# EAGLE design esp32_feather (EAGLE 7.7.0)

## Sheet 1 of 3
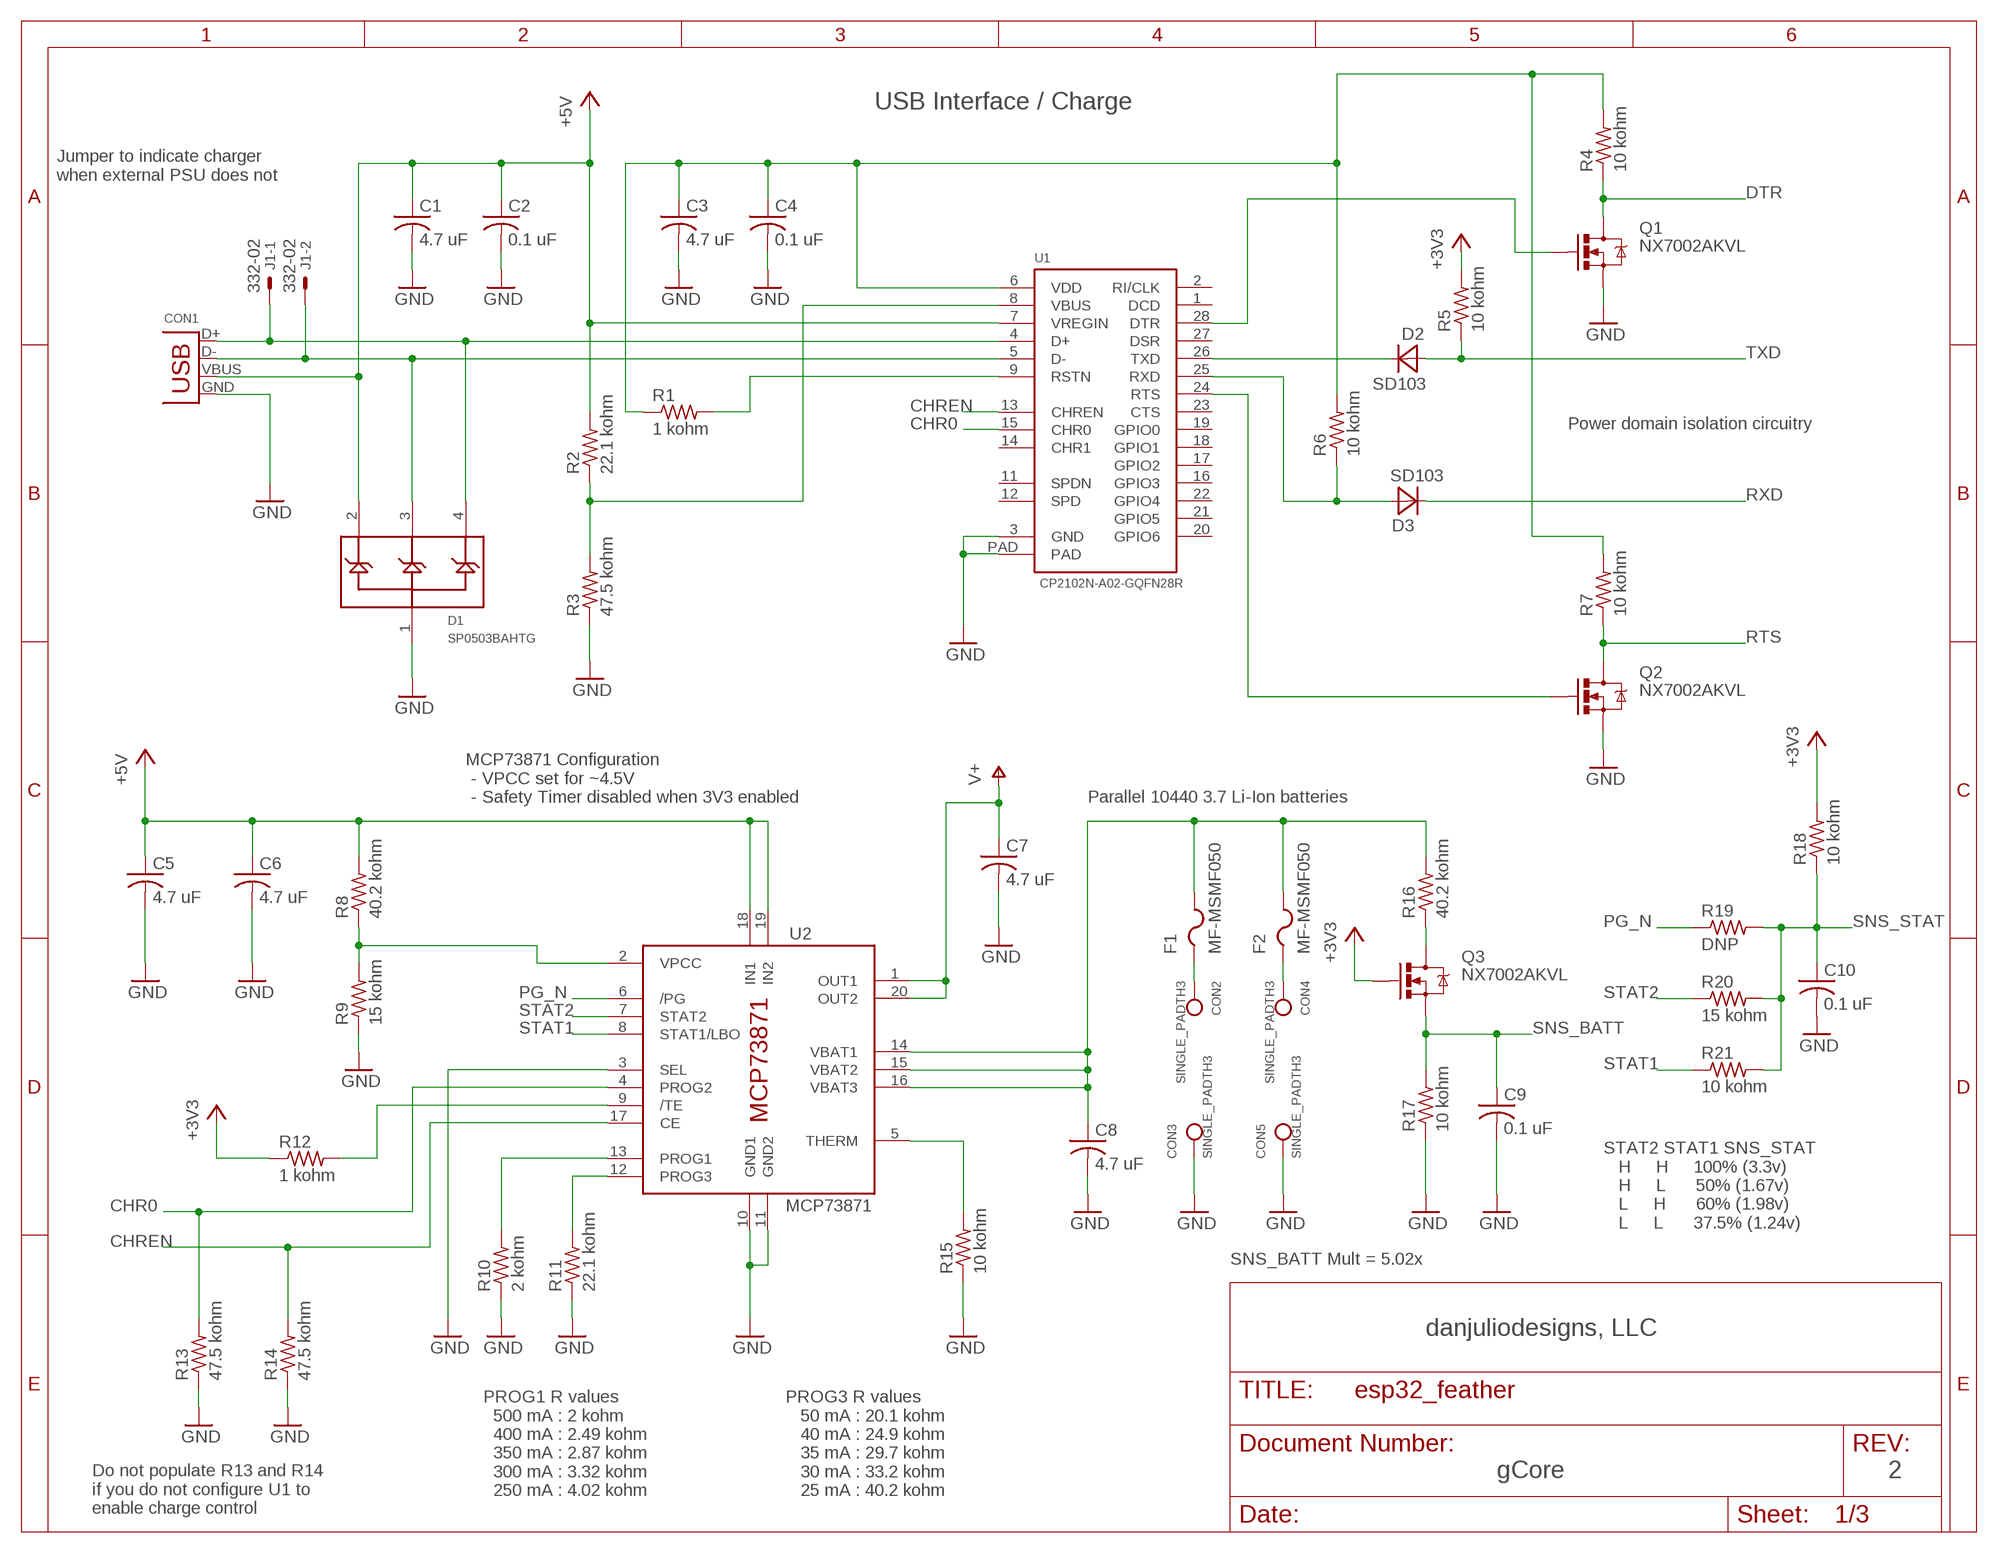
[diagram p0: schematic, sheet 1]

### Parts
C1  4.7 uF  C-USSMT0603  [C0603]
C2  0.1 uF  C-USSMT0603  [C0603]
C3  4.7 uF  C-USSMT0603  [C0603]
C4  0.1 uF  C-USSMT0603  [C0603]
C5  4.7 uF  C-USSMT0603  [C0603]
C6  4.7 uF  C-USSMT0603  [C0603]
C7  4.7 uF  C-USSMT0603  [C0603]
C8  4.7 uF  C-USSMT0603  [C0603]
C9  0.1 uF  C-USSMT0603  [C0603]
C10  0.1 uF  C-USSMT0603  [C0603]
CON1  USBMICROB  [USB_MICROB_SMT]
CON2  SINGLE_PADTH3  [SINGLE_PAD_POWER]
CON3  SINGLE_PADTH3  [SINGLE_PAD_POWER]
CON4  SINGLE_PADTH3  [SINGLE_PAD_POWER]
CON5  SINGLE_PADTH3  [SINGLE_PAD_POWER]
D1  SP0503BAHTG  [SOT143]
D2  SD103  DIODESMT_SOD123  [SOD123]
D3  SD103  DIODESMT_SOD123  [SOD123]
F1  MF-MSMF050  PTCFUSE-1812  [1812]
F2  MF-MSMF050  PTCFUSE-1812  [1812]
J1  332-02  [332-02]
Q1  NX7002AKVL  MOSFET-NCHANNELSOT23  [SOT23-3]
Q2  NX7002AKVL  MOSFET-NCHANNELSOT23  [SOT23-3]
Q3  NX7002AKVL  MOSFET-NCHANNELSOT23  [SOT23-3]
R1  1 kohm  R-USSMT0603  [R0603]
R2  22.1 kohm  R-USSMT0603  [R0603]
R3  47.5 kohm  R-USSMT0603  [R0603]
R4  10 kohm  R-USSMT0603  [R0603]
R5  10 kohm  R-USSMT0603  [R0603]
R6  10 kohm  R-USSMT0603  [R0603]
R7  10 kohm  R-USSMT0603  [R0603]
R8  40.2 kohm  R-USSMT0603  [R0603]
R9  15 kohm  R-USSMT0603  [R0603]
R10  2 kohm  R-USSMT0603  [R0603]
R11  22.1 kohm  R-USSMT0603  [R0603]
R12  1 kohm  R-USSMT0603  [R0603]
R13  47.5 kohm  R-USSMT0603  [R0603]
R14  47.5 kohm  R-USSMT0603  [R0603]
R15  10 kohm  R-USSMT0603  [R0603]
R16  40.2 kohm  R-USSMT0603  [R0603]
R17  10 kohm  R-USSMT0603  [R0603]
R18  10 kohm  R-USSMT0603  [R0603]
R19  DNP  R-USSMT0603  [R0603]
R20  15 kohm  R-USSMT0603  [R0603]
R21  10 kohm  R-USSMT0603  [R0603]
U1  CP2102N-A02-GQFN28R  CP2102N_QFN28  [QFN28]
U2  MCP73871  [QFN20]

### Nets
+3V3: Q3.1(G) R5.2 R12.1 R18.2 ; also sheet 2,3
+5V: C1.1 C2.1 C5.1 C6.1 CON1.VBUS D1.2(C1) R2.2 R8.2 U1.7(VREGIN) U2.18(IN1) U2.19(IN2) ; also sheet 3
CHR0: R13.2 U1.15(CHR0) U2.4(PROG2)
CHREN: R14.2 U1.13(CHREN) U2.17(CE)
DTR: Q1.3(D) R4.1 ; also sheet 2
GND: C1.2 C2.2 C3.2 C4.2 C5.2 C6.2 C7.2 C8.2 C9.2 C10.2 CON1.GND CON3.P$1 CON5.P$1 D1.1(GND) Q1.2(S) Q2.2(S) R3.1 R9.1 R10.1 R11.1 R13.1 R14.1 R15.1 R17.1 U1.3(GND) U1.PAD U2.3(SEL) U2.10(GND1) U2.11(GND2) ; also sheet 2,3
N$1: CON1.D+ D1.4(C3) J1.1 U1.4(D+)
N$2: CON1.D- D1.3(C2) J1.2 U1.5(D-)
N$3: R15.2 U2.5(THERM)
N$4: C8.1 F1.2 F2.2 R16.2 U2.14(VBAT1) U2.15(VBAT2) U2.16(VBAT3)
N$5: R1.2 U1.9(RSTN)
N$6: Q1.1(G) U1.28(DTR)
N$7: R8.1 R9.2 U2.2(VPCC)
N$8: R2.1 R3.2 U1.8(VBUS)
N$9: D2.C U1.26(TXD)
N$10: D3.A R6.1 U1.25(RXD)
N$11: Q2.1(G) U1.24(RTS)
N$12: R10.2 U2.13(PROG1)
N$13: R11.2 U2.12(PROG3)
N$14: CON2.P$1 F1.1
N$15: CON4.P$1 F2.1
N$16: R12.2 U2.9(/TE)
N$18: Q3.3(D) R16.1
PG_N: R19.1 U2.6(/PG)
RTS: Q2.3(D) R7.1 ; also sheet 2
RXD: D3.C ; also sheet 2
SNS_BATT: C9.1 Q3.2(S) R17.2 ; also sheet 2
SNS_STAT: C10.1 R18.1 R19.2 R20.2 R21.2 ; also sheet 2
STAT1: R21.1 U2.8(STAT1/LBO)
STAT2: R20.1 U2.7(STAT2)
TXD: D2.A R5.1 ; also sheet 2
V+: C7.1 U2.1(OUT1) U2.20(OUT2) ; also sheet 2,3
VDD: C3.1 C4.1 R1.1 R4.2 R6.2 R7.2 U1.6(VDD)
Unconnected: U1.1(DCD) U1.2(RI/CLK) U1.11(SPDN) U1.12(SPD) U1.14(CHR1) U1.16(GPIO3) U1.17(GPIO2) U1.18(GPIO1) U1.19(GPIO0) U1.20(GPIO6) U1.21(GPIO5) U1.22(GPIO4) U1.23(CTS) U1.27(DSR)

### Notes on the sheet
- USB Interface / Charge
- Jumper to indicate charger
  when external PSU does not
- Power domain isolation circuitry
- MCP73871 Configuration
   - VPCC set for ~4.5V
   - Safety Timer disabled when 3V3 enabled
- Parallel 10440 3.7 Li-Ion batteries
- STAT2 STAT1 SNS_STAT
     H     H     100% (3.3v)
     H     L      50% (1.67v)
     L     H      60% (1.98v)
     L     L      37.5% (1.24v)
- SNS_BATT Mult = 5.02x
- danjuliodesigns, LLC
- gCore | 2
- PROG1 R values
    500 mA : 2 kohm
    400 mA : 2.49 kohm
    350 mA : 2.87 kohm
    300 mA : 3.32 kohm
    250 mA : 4.02 kohm
- PROG3 R values
     50 mA : 20.1 kohm
     40 mA : 24.9 kohm
     35 mA : 29.7 kohm
     30 mA : 33.2 kohm
     25 mA : 40.2 kohm
- Do not populate R13 and R14
  if you do not configure U1 to
  enable charge control

## Sheet 2 of 3
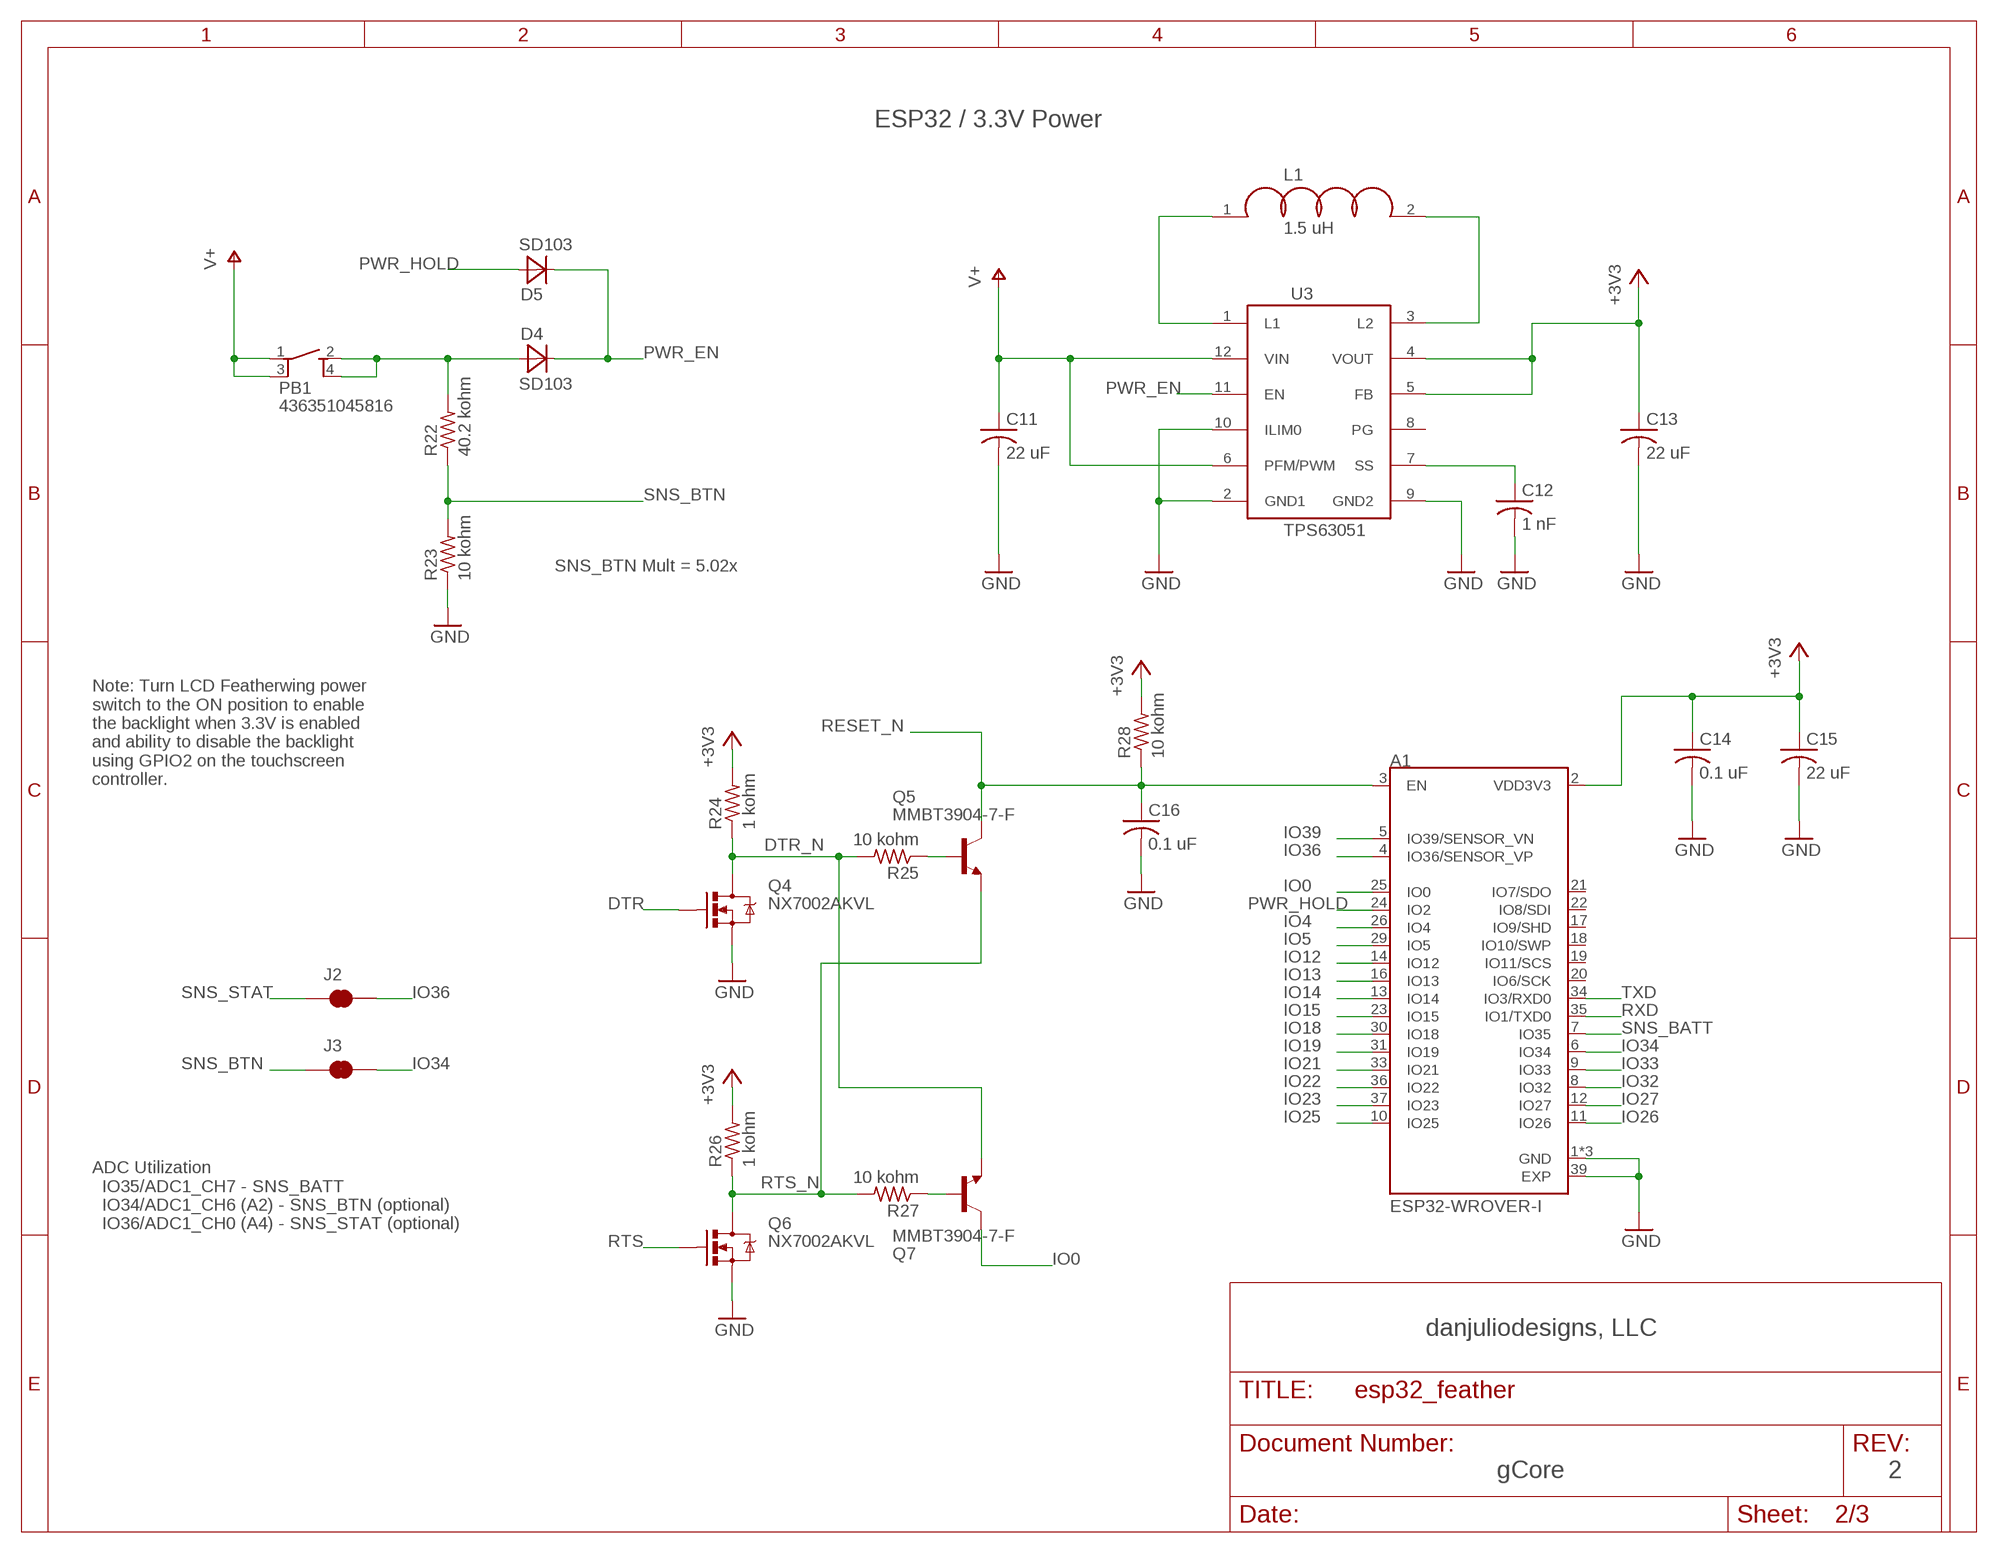
[diagram p1: schematic, sheet 2]

### Parts
A1  ESP32-WROVER-I  [XCVR_ESP32-WROVER-I]
C11  22 uF  C-USSMT0603  [C0603]
C12  1 nF  C-USSMT0603  [C0603]
C13  22 uF  C-USSMT0603  [C0603]
C14  0.1 uF  C-USSMT0603  [C0603]
C15  22 uF  C-USSMT0603  [C0603]
C16  0.1 uF  C-USSMT0603  [C0603]
D4  SD103  DIODESMT_SOD123  [SOD123]
D5  SD103  DIODESMT_SOD123  [SOD123]
J2  SJ_WIRED  [SJ_2B_ADA]
J3  SJ_WIRED  [SJ_2B_ADA]
L1  1.5 uH  INDUCTORSMT1008  [L1008]
PB1  436351045816  PB_TACT_4WS  [WURTH_WS_TASU_TACT]
Q4  NX7002AKVL  MOSFET-NCHANNELSOT23  [SOT23-3]
Q5  MMBT3904-7-F  BC808-NPN-SOT23-BEC  [SOT23-BEC]
Q6  NX7002AKVL  MOSFET-NCHANNELSOT23  [SOT23-3]
Q7  MMBT3904-7-F  BC808-NPN-SOT23-BEC  [SOT23-BEC]
R22  40.2 kohm  R-USSMT0603  [R0603]
R23  10 kohm  R-USSMT0603  [R0603]
R24  1 kohm  R-USSMT0603  [R0603]
R25  10 kohm  R-USSMT0603  [R0603]
R26  1 kohm  R-USSMT0603  [R0603]
R27  10 kohm  R-USSMT0603  [R0603]
R28  10 kohm  R-USSMT0603  [R0603]
U3  TPS63051  TPS63051_QFN  [HOTROD_QFN12]

### Nets
+3V3: A1.2(VDD3V3) C13.1 C14.1 C15.1 R24.2 R26.2 R28.2 U3.4(VOUT) U3.5(FB) ; also sheet 1,3
DTR: Q4.1(G) ; also sheet 1
DTR_N: Q4.3(D) Q7.E R24.1 R25.2
GND: A1.1(GND) A1.15(GND) A1.38(GND) A1.39(EXP) C11.2 C12.2 C13.2 C14.2 C15.2 C16.2 Q4.2(S) Q6.2(S) R23.1 U3.2(GND1) U3.9(GND2) U3.10(ILIM0) ; also sheet 1,3
IO0: A1.25(IO0) Q7.C
IO4: A1.26(IO4) ; also sheet 3
IO5: A1.29(IO5) ; also sheet 3
IO12: A1.14(IO12) ; also sheet 3
IO13: A1.16(IO13) ; also sheet 3
IO14: A1.13(IO14) ; also sheet 3
IO15: A1.23(IO15) ; also sheet 3
IO18: A1.30(IO18) ; also sheet 3
IO19: A1.31(IO19) ; also sheet 3
IO21: A1.33(IO21) ; also sheet 3
IO22: A1.36(IO22) ; also sheet 3
IO23: A1.37(IO23) ; also sheet 3
IO25: A1.10(IO25) ; also sheet 3
IO26: A1.11(IO26) ; also sheet 3
IO27: A1.12(IO27) ; also sheet 3
IO32: A1.8(IO32) ; also sheet 3
IO33: A1.9(IO33) ; also sheet 3
IO34: A1.6(IO34) J3.2 ; also sheet 3
IO36: A1.4(IO36/SENSOR_VP) J2.2 ; also sheet 3
IO39: A1.5(IO39/SENSOR_VN) ; also sheet 3
N$17: L1.1 U3.1(L1)
N$19: L1.2 U3.3(L2)
N$20: C12.1 U3.7(SS)
N$21: D4.A PB1.2 PB1.4 R22.2
N$26: Q5.B R25.1
N$27: Q7.B R27.1
PWR_EN: D4.C D5.C U3.11(EN)
PWR_HOLD: A1.24(IO2) D5.A
RESET_N: A1.3(EN) C16.1 Q5.C R28.1 ; also sheet 3
RTS: Q6.1(G) ; also sheet 1
RTS_N: Q5.E Q6.3(D) R26.1 R27.2
RXD: A1.35(IO1/TXD0) ; also sheet 1
SNS_BATT: A1.7(IO35) ; also sheet 1
SNS_BTN: J3.1 R22.1 R23.2
SNS_STAT: J2.1 ; also sheet 1
TXD: A1.34(IO3/RXD0) ; also sheet 1
V+: C11.1 PB1.1 PB1.3 U3.6(PFM/PWM) U3.12(VIN) ; also sheet 1,3
Unconnected: A1.17(IO9/SHD) A1.18(IO10/SWP) A1.19(IO11/SCS) A1.20(IO6/SCK) A1.21(IO7/SDO) A1.22(IO8/SDI) U3.8(PG)

### Notes on the sheet
- ESP32 / 3.3V Power
- SNS_BTN Mult = 5.02x
- Note: Turn LCD Featherwing power
  switch to the ON position to enable
  the backlight when 3.3V is enabled
  and ability to disable the backlight
  using GPIO2 on the touchscreen
  controller.
- ADC Utilization
    IO35/ADC1_CH7 - SNS_BATT
    IO34/ADC1_CH6 (A2) - SNS_BTN (optional)
    IO36/ADC1_CH0 (A4) - SNS_STAT (optional)
- danjuliodesigns, LLC
- gCore | 2

## Sheet 3 of 3
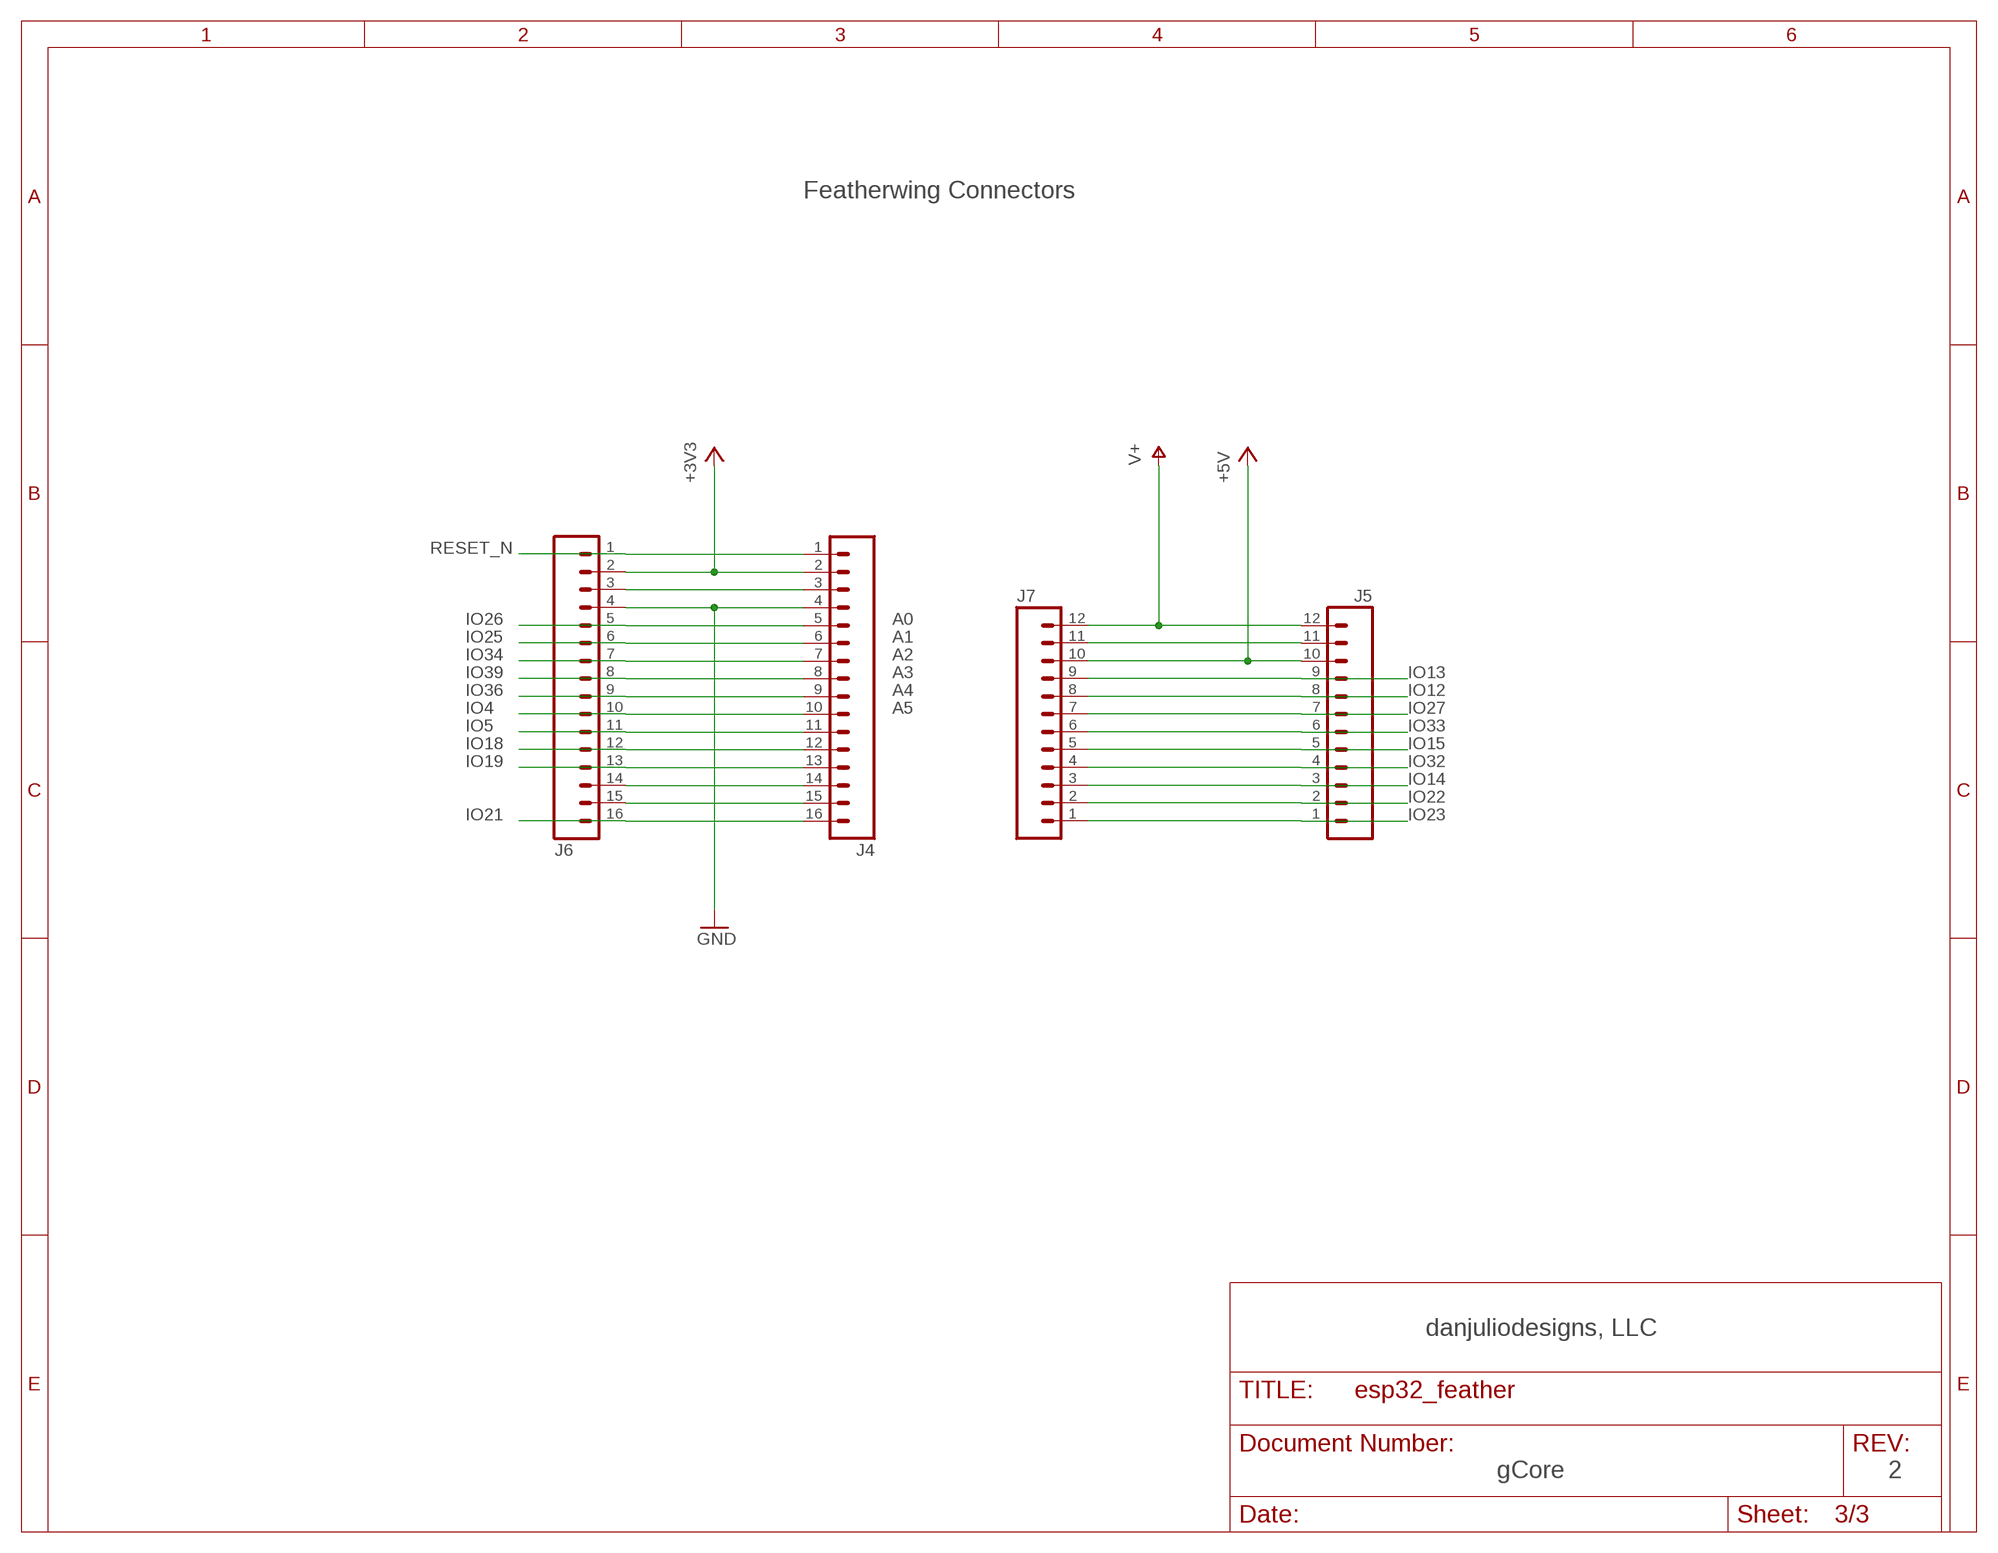
[diagram p2: schematic, sheet 3]

### Parts
J4  M16PTH  [1X16]
J5  M12PTH  [1X12]
J6  M16PTH  [1X16]
J7  M12PTH  [1X12]

### Nets
+3V3: J4.2 J6.2 ; also sheet 1,2
+5V: J5.10 J7.10 ; also sheet 1
FTHR_EN: J5.11 J7.11
GND: J4.4 J6.4 ; also sheet 1,2
IO4: J4.10 J6.10 ; also sheet 2
IO5: J4.11 J6.11 ; also sheet 2
IO12: J5.8 J7.8 ; also sheet 2
IO13: J5.9 J7.9 ; also sheet 2
IO14: J5.3 J7.3 ; also sheet 2
IO15: J5.5 J7.5 ; also sheet 2
IO18: J4.12 J6.12 ; also sheet 2
IO19: J4.13 J6.13 ; also sheet 2
IO21: J4.16 J6.16 ; also sheet 2
IO22: J5.2 J7.2 ; also sheet 2
IO23: J5.1 J7.1 ; also sheet 2
IO25: J4.6 J6.6 ; also sheet 2
IO26: J4.5 J6.5 ; also sheet 2
IO27: J5.7 J7.7 ; also sheet 2
IO32: J5.4 J7.4 ; also sheet 2
IO33: J5.6 J7.6 ; also sheet 2
IO34: J4.7 J6.7 ; also sheet 2
IO36: J4.9 J6.9 ; also sheet 2
IO39: J4.8 J6.8 ; also sheet 2
N$53: J4.3 J6.3
N$64: J4.14 J6.14
N$65: J4.15 J6.15
RESET_N: J4.1 J6.1 ; also sheet 2
V+: J5.12 J7.12 ; also sheet 1,2

### Notes on the sheet
- Featherwing Connectors
- A0
- A1
- A2
- A3
- A4
- A5
- danjuliodesigns, LLC
- gCore | 2

## Library data of the parts
A1 = ESP32-WROVER-I:ESP32-WROVER-I: Module: combo; GPIO, I2C x2, I2S x2, SDIO, SPI x3, UART x3; U.FL; AVAILABILITY: Unavailable; DESCRIPTION: Module: combo; GPIO, I2C x2, I2S x2, SDIO, SPI x3, UART x3; U.FL; MF: Espressif Systems; MP: ESP32-WROVER-I; PACKAGE: Module Espressif Systems; PRICE: None
C1-C16 = djd_eagle_library:C-US
CON1 = djd_eagle_library:USB
CON2-CON5 = djd_eagle_library:SINGLE_PAD
D1 = djd_eagle_library:SP0503BAHTG: Littlefuse SP05 series 3 diode 30 pF 30kV Unidirection TVS Array
D2-D5 = djd_eagle_library:DIODE
F1 F2 = adafruit:PTCFUSE: PTC fuses, resettable thermistors
J1 = con-garry:332-02: 2 Pin - 2mm Dual Row Source: www.mpe-connector.de / garry_shortform_2012.pdf
J2 J3 = djd_eagle_library:SJ_WIRED: Closed solder jumper (cut to open)
J4 J6 = SparkFun-Connectors:M16: 1x16 .1" header
J5 J7 = SparkFun-Connectors:M12: Header 12 Standard 12-pin 0.1" header. Use with straight break away headers (SKU : PRT-00116), right angle break away headers (PRT-00553), swiss pins (PRT-00743), machine pins (PRT-00117), and female headers (PRT-00115).
L1 = djd_eagle_library:INDUCTOR
PB1 = djd_eagle_library:PB_TACT_4: Common 4-pin Tact Button
Q1-Q4 Q6 = djd_eagle_library:MOSFET-NCHANNEL
Q5 Q7 = transistor:*-NPN-: NPN Transistror BF959 corrected 2008.03.06
R1-R28 = djd_eagle_library:R-US
U1 = djd_eagle_library:CP2102N_QFN28
U2 = adafruit:MCP73871
U3 = djd_eagle_library:TPS63051_QFN: TI TPS63051 1A Boost-Buck converter (QFN)

## Board
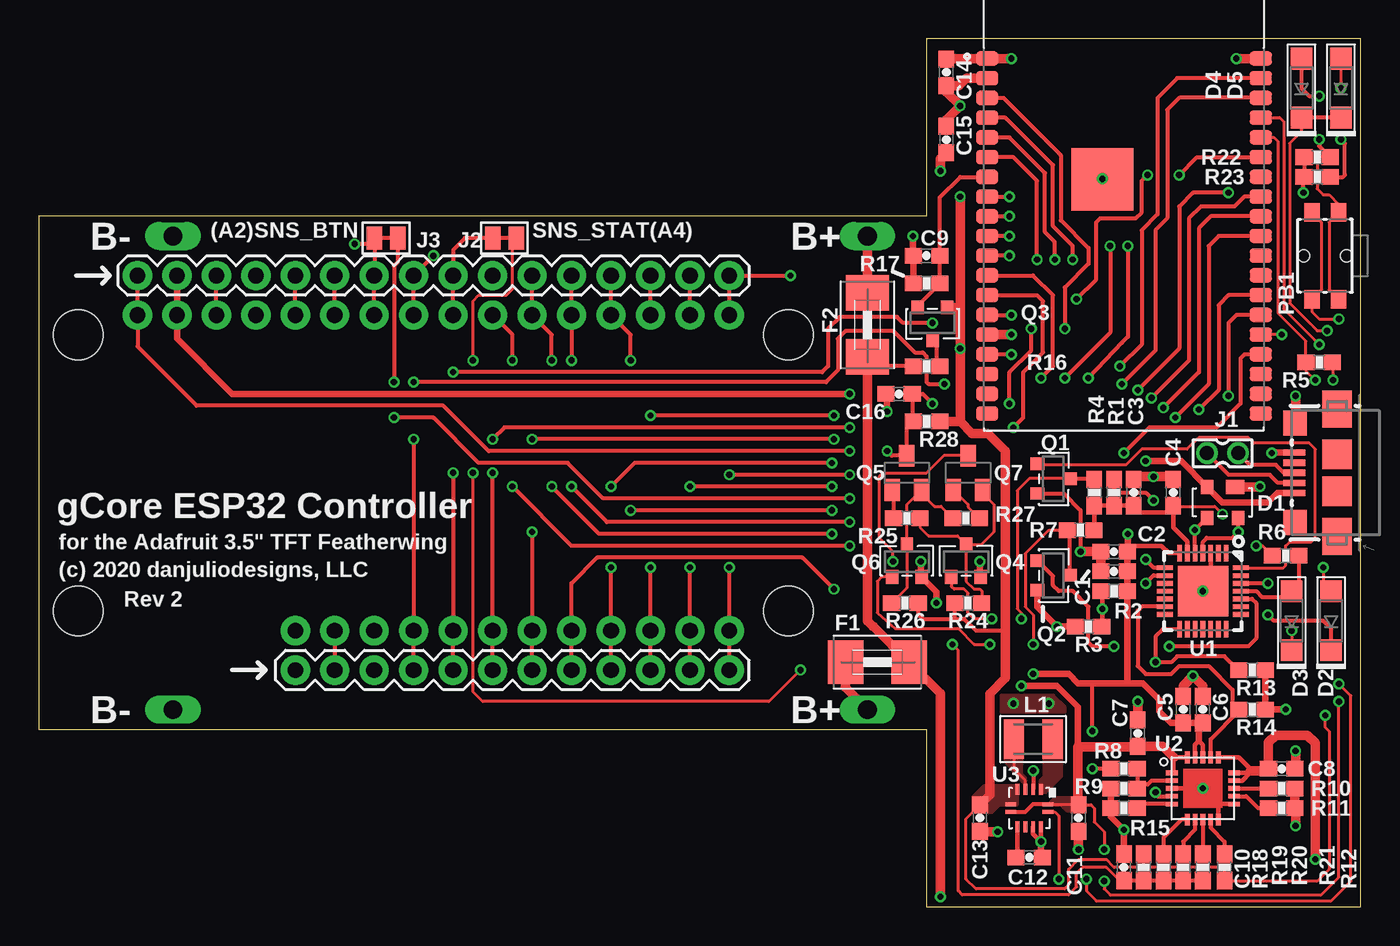
[diagram p3: board, top side]
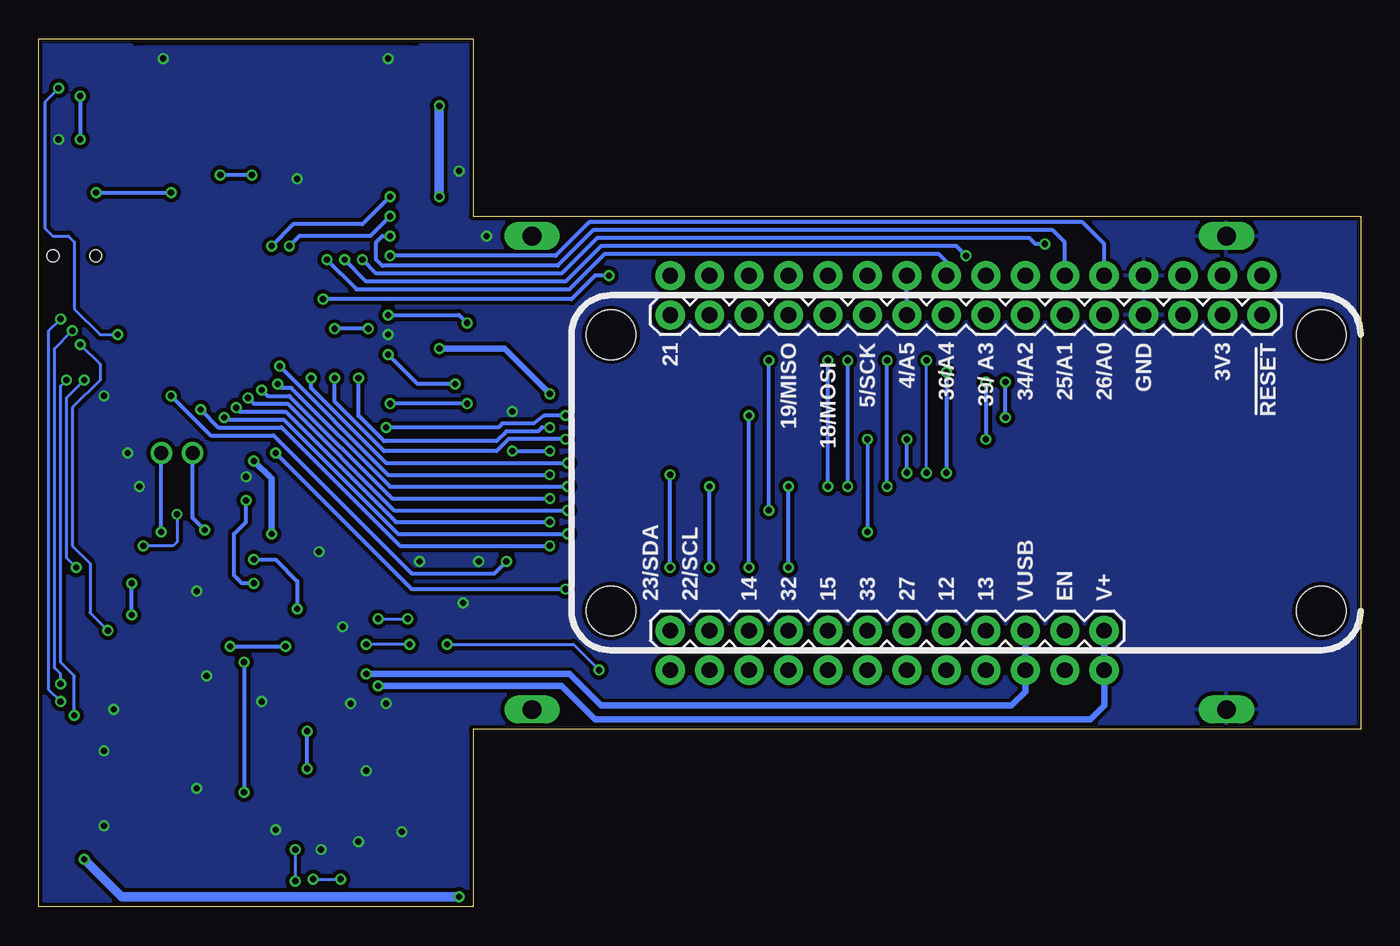
[diagram p4: board, bottom side, seen from below]

Size 85.09 x 55.88 mm. Coordinates in mm from the lower left corner, seen from the top.
Outline: 57.15,0 85.09,0 85.09,55.88 57.15,55.88 57.15,44.45 0,44.45 0,11.43 57.15,11.43 57.15,0
Copper layers (1*16): Top 0.035mm / dielectric 1.5mm / Bottom 0.035mm
Design rules "ITead_rule": minimum track width 6mil, minimum drill 12mil, track to track 6mil, track to pad 6mil, pad to pad 6mil, via to via 6mil, smd to smd 0mil, copper to edge 10mil, drill to drill 10mil, minimum pad ring 10mil, minimum via ring 6mil, stop-mask expansion 2mil, vias tented up to drill 100mil, thermal gap 10mil
Holes 3.2 mm at 2.54,19.05 2.54,36.83 48.26,36.83 48.26,19.05

### Footprints (pad centres in the part's own frame; a part is rotated, then mirrored left to right if it is on the bottom)
XCVR_ESP32-WROVER-I = smd 1.45 x 0.93: 1 -8.81,8.26; 2 -8.81,6.99; 3 -8.81,5.72; 4 -8.81,4.45; 5 -8.81,3.18; 6 -8.81,1.91; 7 -8.81,0.64; 8 -8.81,-0.63; 9 -8.81,-1.9; 10 -8.81,-3.17; 11 -8.81,-4.44; 12 -8.81,-5.71; 13 -8.81,-6.98; 14 -8.81,-8.25; 15 -8.81,-9.52; 16 -8.81,-10.79; 17 -8.81,-12.06; 18 -8.81,-13.33; 19 -8.81,-14.6; 20 8.81,-14.6; 21 8.81,-13.33; 22 8.81,-12.06; 23 8.81,-10.79; 24 8.81,-9.52; 25 8.81,-8.25; 26 8.81,-6.98; 27 8.81,-5.71; 28 8.81,-4.44; 29 8.81,-3.17; 30 8.81,-1.9; 31 8.81,-0.63; 32 8.81,0.64; 33 8.81,1.91; 34 8.81,3.18; 35 8.81,4.45; 36 8.81,5.72; 37 8.81,6.99; 38 8.81,8.26 | smd 4 x 4: 39 -1.38,0.47
C0603 = smd 1.1 x 1: 1 -0.85,0; 2 0.85,0
USB_MICROB_SMT = smd 1.4 x 0.4: D+ 2.75,0; D- 2.75,0.65; GND 2.75,-1.3; ID 2.75,-0.65; VBUS 2.75,1.3 | smd 1.9 x 2.4: SHIELD1 0,4.1; SHIELD4 0,-4.1 | smd 1.9 x 1.9: SHIELD2 0,1.2; SHIELD3 0,-1.2 | smd 1.5 x 1.6: SHIELD5 2.7,3.2; SHIELD6 2.7,-3.2
SINGLE_PAD_POWER = drill 1.2 long: P$1 0,0
SOT143 = smd 1.2 x 0.9: 1 -0.8,-1 | smd 0.8 x 0.9: 2 1,-1; 3 1,1; 4 -1,1
SOD123 = smd 1.4 x 1.4: A 1.9,0; C -1.9,0
1812 = smd 2.286 x 2.794: 1 -2.046,0; 2 2.046,0
332-02 = drill 0.9 pad 1.27: 1 0,-1; 2 0,1
SJ_2B_ADA = smd 1 x 1.5: 1 -0.75,0; 2 0.75,0
1X16 = drill 1.016 pad 1.88: 1 0,0; 2 2.54,0; 3 5.08,0; 4 7.62,0; 5 10.16,0; 6 12.7,0; 7 15.24,0; 8 17.78,0; 9 20.32,0; 10 22.86,0; 11 25.4,0; 12 27.94,0; 13 30.48,0; 14 33.02,0; 15 35.56,0; 16 38.1,0
1X12 = drill 1.016 pad 1.88: 1 0,0; 2 2.54,0; 3 5.08,0; 4 7.62,0; 5 10.16,0; 6 12.7,0; 7 15.24,0; 8 17.78,0; 9 20.32,0; 10 22.86,0; 11 25.4,0; 12 27.94,0
L1008 = smd 1.3 x 2.55: 1 -1.25,0; 2 1.25,0
WURTH_WS_TASU_TACT = smd 1.2 x 1: 1 2.8,0.85; 2 2.8,-0.85; 3 -2.8,0.85; 4 -2.8,-0.85 | hole 0.75: 0,1.375; 0,-1.375
SOT23-3 = smd 0.8 x 0.9: 1 -0.95,-1; 2 0.95,-1; 3 0,1.1
SOT23-BEC = smd 1 x 1.4: B -0.95,-1.1; C 0,1.1; E 0.95,-1.1
R0603 = smd 1.1 x 1: 1 -0.85,0; 2 0.85,0
QFN28 = smd 1.05 x 0.3: 1 -2.45,1.5; 2 -2.45,1; 3 -2.45,0.5; 4 -2.45,0; 5 -2.45,-0.5; 6 -2.45,-1; 7 -2.45,-1.5; 15 2.45,-1.5; 16 2.45,-1; 17 2.45,-0.5; 18 2.45,0; 19 2.45,0.5; 20 2.45,1; 21 2.45,1.5 | smd 0.3 x 1.05: 8 -1.5,-2.45; 9 -1,-2.45; 10 -0.5,-2.45; 11 0,-2.45; 12 0.5,-2.45; 13 1,-2.45; 14 1.5,-2.45; 22 1.5,2.45; 23 1,2.45; 24 0.5,2.45; 25 0,2.45; 26 -0.5,2.45; 27 -1,2.45; 28 -1.5,2.45 | smd 3.25 x 3.25: PAD 0,0
QFN20 = smd 0.75 x 0.3: 1 -2,1; 2 -2,0.5; 3 -2,0; 4 -2,-0.5; 5 -2,-1; 11 2,-1; 12 2,-0.5; 13 2,0; 14 2,0.5; 15 2,1 | smd 0.3 x 0.75: 6 -1,-2; 7 -0.5,-2; 8 0,-2; 9 0.5,-2; 10 1,-2; 16 1,2; 17 0.5,2; 18 0,2; 19 -0.5,2; 20 -1,2
HOTROD_QFN12 = smd 0.7 x 0.25: 1 -1.2,0.75; 2 -1.2,0.25; 3 -1.2,-0.25; 4 -1.2,-0.75; 7 1.2,-0.75; 8 1.2,-0.25; 9 1.2,0.25; 10 1.2,0.75 | smd 0.25 x 0.7: 5 -0.25,-1.2; 6 0.25,-1.2; 11 0.25,1.2; 12 -0.25,1.2

### Placement (x,y rotation side)
A1  69.85,46.35 0 top
C1  69.22,21.59 180 top
C2  69.22,22.86 180 top
C3  70.48,26.67 90 top
C4  73.03,26.67 90 top
C5  73.66,12.7 90 top
C6  74.93,12.7 90 top
C7  70.74,11.18 90 top
C8  80.01,8.89 0 top
C9  57.15,41.91 180 top
C10  69.85,2.54 90 top
C11  66.93,5.71 270 top
C12  63.75,3.17 0 top
C13  60.58,5.71 270 top
C14  58.42,53.72 90 top
C15  58.42,49.4 270 top
C16  55.37,33.02 180 top
CON1  83.57,27.94 180 top
CON2  53.34,12.7 0 top
CON3  8.64,12.7 0 top
CON4  53.34,43.18 0 top
CON5  8.64,43.18 0 top
D1  76.2,26.04 180 top
D2  83.19,18.41 90 top
D3  80.64,18.41 90 top
D4  81.28,52.7 90 top
D5  83.82,52.7 90 top
F1  53.98,15.75 0 top
F2  53.34,37.47 270 top
J1  76.2,29.21 90 top
J2  29.97,43.05 180 top
J3  22.35,43.05 180 top
J4  6.35,38.1 180 bottom
J5  44.45,15.24 180 top
J6  6.35,40.64 0 top
J7  44.45,17.78 0 bottom
L1  64.01,10.79 180 top
PB1  82.8,41.91 90 top
Q1  65.28,27.56 270 top
Q2  65.28,21.34 270 top
Q3  57.53,37.59 180 top
Q4  59.69,22.23 0 top
Q5  55.88,27.94 0 top
Q6  55.88,22.23 0 top
Q7  59.82,27.94 0 top
R1  69.22,26.67 90 top
R2  69.22,20.32 0 top
R3  67.56,18.03 0 top
R4  67.94,26.67 270 top
R5  82.42,35.05 0 top
R6  80.26,22.61 180 top
R7  67.06,24.26 0 top
R8  69.85,8.89 180 top
R9  69.85,7.62 0 top
R10  80.01,7.62 180 top
R11  80.01,6.35 180 top
R12  76.33,2.54 90 top
R13  78.11,15.24 180 top
R14  78.11,12.7 180 top
R15  69.85,6.35 0 top
R16  57.15,34.8 180 top
R17  57.15,40.13 0 top
R18  71.12,2.54 90 top
R19  72.39,2.54 270 top
R20  73.66,2.54 270 top
R21  74.93,2.54 270 top
R22  82.3,48.26 0 top
R23  82.3,46.99 180 top
R24  59.82,19.56 180 top
R25  55.88,25.02 0 top
R26  55.75,19.56 0 top
R27  59.69,25.02 180 top
R28  57.15,31.24 0 top
U1  74.93,20.32 270 top
U2  74.93,7.62 0 top
U3  63.75,6.35 270 top

### Tracks (layer width: path | path; a pad name or v marks a point on that pad's centre or on a via)
+3V3  (via drill 0.4)
  Top 0.203: 71.12,2.54 76.07,2.54 76.33,2.29 R12.1 76.37,1.65 82.3,1.65 83.06,2.41 83.06,11.3 82.8,11.56 v82.8,12.32 | 71.12,2.54 69.22,2.54 68.71,3.05 66.93,3.05 66.29,2.41 66.29,1.4 66.04,1.14 60.33,1.14 59.69,1.78 59.69,5.68 C13.1 | 71.12,2.54 R18.2 | v83.31,33.91 83.31,35.01 R5.2
  Top 0.254: R26.2 56.6,18.84 56.9,18.54 58.93,18.54 | 58.93,18.54 59.56,18.54 60.33,17.78 62.23,17.78 | R24.2 58.93,19.56 58.93,18.54
  Top 0.406: J6.2 J4.2 8.89,36.58 12.45,33.02 v52.2,33.02
  Top 0.61: C15.1 58.42,50.67 v59.31,51.56 58.42,52.45 C14.1 59.22,52.87 59.7,53.34 A1.2 | 59.31,38.61 v59.31,35.94 59.31,31.24 | 59.31,31.24 60.07,30.48 61.09,30.48 62.23,29.34 62.23,17.78 62.23,14.73 61.21,13.72 61.21,7.2 C13.1 | Q3.1 59.29,38.59 59.31,38.61 | R28.2 59.31,31.24 | 59.31,38.61 v59.31,45.72
  Bottom 0.203: v82.8,12.32 82.8,14.86 83.69,15.75 83.69,33.53 v83.31,33.91
  Bottom 0.406: v59.31,35.94 55.12,35.94 v52.2,33.02
  Bottom 0.61: v59.31,45.72 v59.31,51.56
  pour Top (no thermals): 60.2,6.1 61.34,6.1 61.85,6.6 62.99,6.6 62.99,7.75 60.83,7.75 60.2,7.11
+5V  (via drill 0.4)
  Top 0.254: R8.2 v67.82,8.89 | v67.82,11.3 67.82,14.39
  Top 0.305: U2.18 74.93,10.41 74.68,10.67 74.43,10.42 U2.19 | U1.7 72.73,22.77 72.26,23.24 70.45,23.24 C2.1
  Top 0.406: CON1.VBUS 79.73,26.64 79.12,26.04 76.2,26.04 D1.2 73.53,28.7 v71.25,28.7 | 70.06,14.39 R2.2 C1.1 C2.1 70.1,22.86 v70.1,24 | 74.68,10.67 74.68,11.56 74.93,11.81 C6.1 C5.1 72.86,11.85 72.14,12.57 72.14,13.34 71.08,14.39 70.06,14.39 | 70.06,14.39 67.82,14.39 66.89,14.39 66.29,14.99 v64.01,14.99
  Bottom 0.254: v67.82,8.89 v67.82,11.3
  Bottom 0.406: v70.1,24 70.1,27.56 v71.25,28.7 | v64.01,14.99 50.93,14.99 48.9,12.95 22.48,12.95 21.59,13.84 J5.10 J7.10
CHR0  (via drill 0.4)
  Top 0.254: U1.15 72.35,17.87 71.88,17.4 v71.88,15.75 72.9,15.75 73.28,16.13 76.33,16.13 77.22,15.24 R13.2 | v71.88,7.37 71.88,7.24 72.01,7.11 U2.4
  Bottom 0.254: v71.88,15.75 v71.88,7.37
CHREN
  Top 0.254: U1.13 71.01,19.32 70.74,19.05 70.74,15.49 71.25,14.99 72.9,14.99 73.41,15.49 75.31,15.49 76.83,13.97 76.83,13.12 R14.2 77.25,12.61 75.43,10.79 U2.17
DTR  (via drill 0.4)
  Top 0.203: 58.8,21.29 Q4.1 58.74,20.64 58.93,20.45 59.56,20.45 59.82,20.19 59.82,18.92 60.2,18.54 v61.34,18.54 | Q1.3 63.75,27.56 62.99,26.8 62.99,19.18 63.25,18.92 v63.25,18.54
  Top 0.254: Q1.3 67.91,27.56 R4.1
  Bottom 0.203: v63.25,18.54 v61.34,18.54
DTR_N
  Top 0.203: R25.2 56.73,24.42 57.28,23.88 59.14,23.88 Q4.3 | Q7.E 60.77,26.61 61.47,25.91 61.47,24.13 60.66,23.32 Q4.3 | Q4.3 59.69,20.95 60.2,20.45 60.58,20.45 60.71,20.32 60.71,19.6 R24.1
FTHR_EN
  Top 0.254: J7.11 J5.11
GND  (via drill 0.4)
  Top 0.254: v64.01,8.76 U3.2 | R23.1 83.95,46.99 84.07,47.12 84.07,49.15 v83.82,49.4 | Q1.2 65.97,26.61 67.06,25.53 v67.06,22.86 | v68.45,46.86 68.45,46.84 A1.39
  Top 0.305: U1.3 75.43,20.82 U1.PAD | U2.3 v74.93,7.62 75.93,6.62 | U2.10 75.93,6.62 | U2.11 75.93,6.62 | U3.10 64.5,4.2 v64.52,4.19 64,4.7 U3.9
  Top 0.406: CON1.GND 79.41,29.24 v79.38,29.21 | R9.1 R15.1 69,5.8 v69.85,4.95 C10.2 | v64.52,4.19 64.52,3.26 C12.2 | R13.1 R14.1 v80.26,12.7 | R3.1 v65.53,18.03 64.28,19.29 Q2.2 | 64.26,26.59 Q1.2 | v60.58,22.23 60.58,21.29 Q4.2 | v56.77,22.23 56.77,21.29 Q6.2 57.78,20.27 v57.78,19.56 | v54.61,31.88 54.61,32.93 C16.2 | R17.1 C9.2 56.26,41.95 v56.26,43.18
  Top 0.61: D1.1 78.6,27.04 v78.61,27.05 | v80.9,32.89 80.9,31.24 | v70.74,13.21 C7.2 | C5.2 73.66,14.22 v74.3,14.86 74.93,14.22 C6.2 | C3.2 70.65,27.69 v71.75,27.69 72.86,27.69 C4.2 | 66.89,4.83 C11.2 v66.93,3.68 | v61.72,4.83 60.62,4.83 C13.2 | v62.61,54.61 v62.61,54.62 A1.1 58.46,54.62 C14.2 | v58.04,47.37 58.04,48.17 C15.2 | v77.09,54.61 A1.38 | v80.9,10.03 80.9,8.93 C8.2 | v80.9,5.21 80.9,6.31 R11.1 R10.1 | v62.61,36.83 A1.15 | v67.06,22.86 C2.2 C1.2
  other vias: 74.93,20.32 62.74,13.08 65.02,13.08
  pour Bottom (isolate 0.254): 0,11.43 0,44.45 57.15,44.45 57.15,55.88 85.09,55.88 85.09,0 57.15,0 57.15,11.43
  pour Top: 61.98,12.57 66.04,12.57 66.04,12.83 65.28,13.59 61.98,13.59
IO0  (via drill 0.4)
  Top 0.203: v54.99,22.23 54.99,22.86 54.1,23.75 54.1,27.69 54.36,27.94 57.15,27.94 58.29,29.08 59.77,29.08 Q7.C
  Top 0.254: A1.25 77.09,38.1 76.58,37.59 v76.58,32.89
  Bottom 0.254: v76.58,32.89 74.04,30.35 69.98,30.35 61.09,21.46 55.75,21.46 v54.99,22.23
IO4  (via drill 0.4)
  Top 0.254: 29.22,40.65 J6.10 | A1.26 76.59,39.38 75.95,38.73 75.95,33.27 v74.68,32 | v52.2,23.24 34.29,23.24 v30.48,27.05 | v30.48,35.18 30.48,36.83 J4.10
  Bottom 0.254: J4.10 J6.10 | v74.68,32 73.53,30.86 69.47,30.86 61.85,23.24 v52.2,23.24 | v30.48,27.05 v30.48,35.18
IO5  (via drill 0.4)
  Top 0.254: J6.11 J4.11 33.02,36.83 v33.02,35.18 | A1.29 75.95,43.19 75.31,42.55 75.31,33.66 v73.15,31.5 | v51.05,24 36.07,24 v33.02,27.05
  Bottom 0.254: v73.15,31.5 73.03,31.37 69.34,31.37 61.98,24 v51.05,24 | v33.02,27.05 v33.02,35.18
IO12  (via drill 0.4)
  Top 0.254: J5.8 J7.8 v26.67,27.94 | A1.14 62.73,38.1 v62.61,38.1 | v57.53,37.59 55.63,37.59 55.24,37.97 51.56,37.97 50.8,37.21 50.8,34.8 50.42,34.42 v26.67,34.42
  Bottom 0.254: v62.61,38.1 58.04,38.1 v57.53,37.59 | v26.67,34.42 v26.67,27.94
IO13  (via drill 0.4)
  Top 0.254: J5.9 J7.9 v24.13,30.1 | v58.29,33.66 57.28,33.66 57.15,33.78 57.15,35.43 56.9,35.69 56.39,35.69 54.99,37.08 51.94,37.08 51.44,36.58 51.44,34.54 50.67,33.78 v24.13,33.78 | v62.61,35.56 A1.16
  Bottom 0.254: v58.29,33.66 60.71,33.66 v62.61,35.56 | v24.13,33.78 v24.13,30.1
IO14  (via drill 0.4)
  Top 0.254: v39.37,21.84 J7.3 J5.3 | A1.13 64.26,39.38 64.64,38.99 64.64,35.69 63.37,34.42 63.37,31.5 v62.74,30.86 | v51.18,31.62 v39.37,31.62
  Bottom 0.254: v51.18,31.62 52.58,31.62 53.21,31.11 55.24,31.11 55.5,30.86 v62.74,30.86 | v39.37,21.84 v39.37,31.62
IO15  (via drill 0.4)
  Top 0.254: J5.5 J7.5 34.29,20.83 35.94,22.48 49.15,22.48 v51.18,20.45 | A1.23 77.6,35.56 77.34,35.31 77.34,32.38 75.82,30.86 71.5,30.86 v69.85,29.21
  Bottom 0.254: v69.85,29.21 61.09,20.45 v51.18,20.45
IO18  (via drill 0.4)
  Top 0.254: v34.29,35.18 J4.12 J6.12 | A1.30 75.44,44.45 74.68,43.69 74.68,34.42 v72.39,32.13 | v52.2,24.77 36.58,24.77 v34.29,27.05
  Bottom 0.254: v72.39,32.13 72.14,31.88 69.22,31.88 62.1,24.77 v52.2,24.77 | v34.29,27.05 v34.29,35.18
IO19  (via drill 0.4)
  Top 0.254: J6.13 J4.13 38.1,36.83 v38.1,35.18 | A1.31 77.6,45.73 76.96,45.09 74.8,45.09 74.04,44.32 74.04,35.18 v71.63,32.77 | v51.05,25.53 v38.1,25.53
  Bottom 0.254: v71.63,32.77 71.25,32.38 69.09,32.38 62.23,25.53 v51.05,25.53 | v38.1,25.53 v38.1,35.18
IO21  (via drill 0.4)
  Top 0.254: J4.16 J6.16 v48.39,40.64 | v66.8,39.12 68.07,40.39 68.07,44.07 68.33,44.32 70.61,44.32 70.99,44.7 70.99,46.74 v71.37,47.12 | v73.41,47.12 74.55,48.26 A1.33
  Top 0.305: A1.33
  Bottom 0.254: v48.39,40.64 49.28,40.64 50.8,39.12 v66.8,39.12 | v71.37,47.12 v73.41,47.12
IO22  (via drill 0.4)
  Top 0.254: J5.2 J7.2 v41.91,21.84 | A1.36 73.41,52.08 72.64,51.31 72.64,44.32 71.88,43.56 71.88,35.81 v69.72,33.66 | v51.05,27.05 v41.91,27.05
  Bottom 0.254: v51.05,27.05 62.48,27.05 68.83,33.4 69.47,33.4 v69.72,33.66 | v41.91,21.84 v41.91,27.05
IO23  (via drill 0.4)
  Top 0.254: v44.45,21.84 J7.1 J5.1 | A1.37 73.28,53.34 72.01,52.07 72.01,44.58 70.99,43.56 70.99,36.2 v69.6,34.8 | v52.2,27.81 v44.45,27.81
  Bottom 0.254: v69.6,34.8 62.61,27.81 v52.2,27.81 | v44.45,21.84 v44.45,27.81
IO25  (via drill 0.4)
  Top 0.254: J4.6 J6.6 | v62.48,43.18 A1.10
  Bottom 0.254: J6.6 19.05,42.8 19.81,43.56 49.4,43.56 51.69,41.27 62.99,41.27 63.37,41.66 63.37,42.8 62.99,43.18 v62.48,43.18
IO26  (via drill 0.4)
  Top 0.254: J4.5 J6.5 | v62.48,41.91 61.16,41.91 A1.11
  Bottom 0.254: J6.5 16.51,42.67 17.91,44.07 49.66,44.07 51.82,41.91 v62.48,41.91
IO27  (via drill 0.4)
  Top 0.254: A1.12 64,40.65 65.28,39.37 65.28,34.8 v64.52,34.04 | J5.7 J7.7 v29.21,27.94 | v52.2,30.86 29.97,30.86 v29.21,30.1 29.34,30.23
  Bottom 0.254: v64.52,34.04 64.52,31.62 62.87,29.97 55.63,29.97 54.99,30.61 52.96,30.61 52.7,30.86 v52.2,30.86 | v29.21,27.94 v29.21,30.1
IO32  (via drill 0.4)
  Top 0.254: A1.8 v62.48,45.73 | v36.83,21.84 J7.4 J5.4 | v67.56,34.04 69.72,36.32 70.1,36.7 v70.1,42.55 | v51.05,28.57 38.35,28.57 v36.83,27.05
  Bottom 0.254: v62.48,45.73 64.26,43.94 68.71,43.94 v70.1,42.55 | v51.05,28.57 62.74,28.57 67.56,33.4 v67.56,34.04 | v36.83,21.84 v36.83,27.05
IO33  (via drill 0.4)
  Top 0.254: A1.9 v62.48,44.45 | J5.6 J7.6 v31.75,24.13 | v66.04,34.04 68.96,36.96 v68.96,42.55 | v51.18,30.1 v31.75,30.1
  Bottom 0.254: v62.48,44.45 63.75,43.18 68.33,43.18 v68.96,42.55 | v66.04,34.04 66.04,32.51 62.87,29.34 55.63,29.34 54.86,30.1 v51.18,30.1 | v31.75,30.1 v31.75,24.13
IO34  (via drill 0.4)
  Top 0.254: J4.7 J6.7 21.6,40.65 J3.2 21.22,42.67 v20.32,42.67 | v64.26,41.66 64.26,46.74 62.74,48.26 A1.6
  Bottom 0.254: v20.32,42.67 20.95,42.67 21.34,43.05 49.15,43.05 51.44,40.77 63.37,40.77 v64.26,41.66
IO36  (via drill 0.4)
  Top 0.254: v66.55,41.66 66.55,42.55 65.28,43.81 65.28,47.75 62.23,50.8 A1.4 | J4.9 J6.9 26.67,42.29 27.43,43.05 J2.2
  Bottom 0.254: v66.55,41.66 64.64,39.75 50.93,39.75 48.64,42.04 27.18,42.04 26.67,41.53 J6.9
IO39  (via drill 0.4)
  Top 0.254: J4.8 J6.8 v25.4,41.91 | v65.41,41.66 65.41,42.8 64.77,43.43 64.77,47.24 62.48,49.53 A1.5
  Bottom 0.254: v25.4,41.91 26.04,42.55 48.9,42.55 51.18,40.26 64.01,40.26 v65.41,41.66
N$1  (via drill 0.4)
  Top 0.254: CON1.D+ 80.14,27.94 79.63,28.45 77.96,28.45 J1.1 | U1.4 74.93,23.5 75.18,23.75 76.83,23.75 v77.22,24.13 77.22,25.02 D1.4
  Bottom 0.254: v77.22,24.13 77.22,29.19 J1.1
N$2  (via drill 0.4)
  Top 0.254: CON1.D- 79.77,27.29 79.25,27.81 76.6,27.81 J1.2 | U1.5 74.43,24.25 v74.42,24.26 D1.3
  Bottom 0.254: J1.2 D1.3 v74.42,24.26
N$3
  Top 0.254: U2.5 70.97,6.62 R15.2
N$4  (via drill 0.4)
  Top 0.254: R16.2 53.96,34.8 F2.2
  Top 0.305: U2.15 77.96,8.62 | 77.96,8.62 77.98,8.76 | U2.14 77.46,8.12 77.96,8.62 | U2.16 77.25,9.62 77.96,8.91 77.96,8.62
  Top 0.61: 77.98,8.76 79.03,8.76 C8.1 79.16,10.58 79.63,11.05 81.66,11.05 82.17,10.54 v82.17,3.05 | v58.04,0.64 58.04,13.73 F1.2 53.72,18.05 53.71,18.05 53.34,18.41 F2.2
  Bottom 0.61: v82.17,3.05 79.76,0.64 v58.04,0.64
N$5  (via drill 0.4)
  Top 0.254: R1.2 69.22,26.8 69.34,26.67 71.25,26.67 v71.75,26.16 | v71.25,20.83 71.75,21.34 72.46,21.34 U1.9
  Bottom 0.254: v71.25,20.83 72.01,20.83 72.52,21.34 72.52,24 71.75,24.77 v71.75,26.16
N$6
  Top 0.203: U1.28 80.11,21.82 80.26,21.97 80.26,23.24 80.52,23.5 81.92,23.5 82.17,23.75 82.17,29.46 81.79,29.84 78.23,29.84 77.85,30.23 74.68,30.23 73.91,29.46 70.99,29.46 69.98,28.45 64.34,28.45 Q1.1
N$7
  Top 0.254: U2.2 71.62,8.12 71.37,7.87 70.95,7.87 R9.2 R8.1
N$8  (via drill 0.4)
  Top 0.254: U1.8 71.78,21.82 v71.25,22.35
  Top 0.305: R3.2 68.45,18.07 v68.45,19.18 68.45,20.23 R2.1
  Bottom 0.254: v71.25,22.35 69.85,22.35 68.45,20.95 v68.45,19.18
N$9  (via drill 0.4)
  Top 0.254: D2.C 83.19,17.91 82.68,18.41 79.5,18.41 v79.12,18.8 | v79.12,20.83 U1.26
  Bottom 0.254: v79.12,18.8 v79.12,20.83
N$10
  Top 0.254: U1.25 78.36,20.32 78.74,19.94 80.27,19.94 D3.A 81.11,20.78 R6.1
N$11  (via drill 0.4)
  Top 0.254: U1.24 78.1,19.82 78.36,19.56 78.36,17.27 77.85,16.76 v72.77,16.76 | v69.22,16.76 67.82,16.76 67.56,17.02 67.56,19.3 66.55,20.32 65.66,20.32 65.28,20.7 65.28,21.29 Q2.1
  Bottom 0.254: v72.77,16.76 v69.22,16.76
N$12
  Top 0.254: U2.13 R10.2
N$13
  Top 0.254: R11.2 78.49,6.35 77.72,7.12 U2.12
N$14
  Top 0.61: F1.1 51.93,14.11 CON2.P$1
N$15
  Top 0.61: F2.1 CON4.P$1
N$16
  Top 0.254: U2.9 75.43,5.09 76.33,4.19 R12.2
N$17
  pour Top (no thermals): 64.52,7.37 64.52,8.13 64.77,8.38 64.77,11.94 65.79,11.94 65.79,8.38 64.77,7.37
N$18
  Top 0.254: Q3.3 57.62,36.49 57.78,36.32 57.78,35.01 R16.1
N$19
  Top 0.203: U3.3 63.5,8.12 62.76,8.87 L1.2
  pour Top (no thermals): 63.5,7.87 63.5,8.26 63.25,8.51 63.25,11.94 62.23,11.94 62.23,9.4
N$20
  Top 0.305: U3.7 63,3.27 C12.1
N$21  (via drill 0.4)
  Top 0.203: PB1.4 83.06,39.71 83.06,44.07 83.65,44.66 PB1.2 83.65,45.25 83.06,45.85 82.68,45.85 82.3,46.23 82.3,48.13 82.42,48.26 R22.2
  Top 0.254: D4.A 81.28,52.7 81.79,52.2 v82.43,52.2 | v82.42,49.4 82.42,48.98 R22.2
  Bottom 0.254: v82.43,52.2 v82.42,52.2 v82.42,49.4
N$26
  Top 0.254: R25.1 55.03,26.74 Q5.B
N$27
  Top 0.203: 58.84,26.81 58.91,26.81 59.82,25.91 59.82,25.74 R27.1
  Top 0.254: 58.84,26.81 Q7.B
N$53
  Top 0.254: J4.3 J6.3
N$64
  Top 0.254: J4.14 J6.14
N$65
  Top 0.254: J4.15 J6.15
PG_N
  Top 0.254: U2.6 73.56,5.62 72.39,4.45 R19.1
PWR_EN  (via drill 0.4)
  Top 0.203: U3.11 65.4,6.1 65.66,5.84 v65.66,1.78 | D4.C 81.28,49.91 80.52,49.15 80.52,38.86 82.3,37.08 v82.93,37.08 | v83.69,14.35 84.45,13.59 84.45,1.65 83.19,0.38 68.07,0.38 67.44,1.02 v67.44,1.78
  Top 0.254: D5.C D4.C
  Bottom 0.203: v67.44,1.78 v65.66,1.78 | v83.69,14.35 83.69,14.99 84.07,15.37 84.07,35.94 v82.93,37.08
PWR_HOLD  (via drill 0.4)
  Top 0.203: D5.A v83.82,52.7 | v80.01,36.83 A1.24
  Bottom 0.203: v83.82,52.7 84.71,51.82 84.71,43.69 84.2,43.18 83.19,43.18 82.8,42.8 82.8,38.48 81.15,36.83 v80.01,36.83
RESET_N  (via drill 0.4)
  Top 0.254: J6.1 J4.1 6.35,36.07 10.16,32.26 26.04,32.26 28.96,29.34 v52.2,29.34 | v57.53,32.38 56.9,33.02 C16.1 56.22,31.32 R28.1 55.88,30.82 Q5.C 54.91,29.04 v54.61,29.34 | A1.3 62.1,52.08 65.79,48.39 65.79,44.2 67.56,42.42 67.56,41.4 66.04,39.88 v66.04,37.21 | v62.48,32.38 62.48,34.42 63.88,35.81 v63.88,37.21
  Bottom 0.254: v57.53,32.38 v62.48,32.38 | v63.88,37.21 v66.04,37.21 | v54.61,29.34 v52.2,29.34
RTS  (via drill 0.4)
  Top 0.203: Q6.1 54.24,21.23 53.98,20.95 53.98,18.92 55.12,17.91 59.18,17.91 60.2,16.89 v61.21,16.89 | R7.1 65.02,24.26 63.5,22.73 63.5,19.3 64.01,18.8 v64.01,16.89
  Top 0.254: Q2.3 66.38,24.09 R7.1
  Bottom 0.203: v61.21,16.89 v64.01,16.89
RTS_N
  Top 0.203: R27.2 58.08,25.78 57.66,25.78 56.83,26.61 Q5.E 55.88,25.89 Q6.3 55.88,20.54 R26.1
RXD  (via drill 0.4)
  Top 0.203: A1.35 79.88,50.8 80.14,50.55 80.14,38.48 v82.42,36.2 | v80.64,17.78 D3.C
  Bottom 0.203: v82.42,36.2 81.15,34.92 81.15,33.91 82.93,32.13 82.93,23.24 81.79,22.1 81.79,18.92 v80.64,17.78
SNS_BATT
  Top 0.254: Q3.2 56.58,38.71 R17.2 C9.1 58,45.68 59.31,46.99 A1.7
SNS_BTN  (via drill 0.4)
  Top 0.254: R22.1 R23.2 81.41,46.95 v81.41,45.97 | J3.1 23.1,41.52 22.86,41.27 v22.86,33.78 | v76.58,45.97 74.3,45.97 73.41,45.09 73.41,35.94 v70.74,33.27 | v52.2,26.29 36.32,26.29 34.04,28.57 28.32,28.57 25.4,31.5 v22.86,31.5
  Bottom 0.254: v81.41,45.97 v76.58,45.97 | v70.74,33.27 70.36,32.89 68.96,32.89 62.36,26.29 v52.2,26.29 | v22.86,31.5 v22.86,33.78
SNS_STAT  (via drill 0.4)
  Top 0.203: C10.1 69.56,1.69 68.71,2.54 67.18,2.54 66.8,2.16 66.8,1.27 66.29,0.76 59.44,0.76 59.18,1.02 59.18,16.51 v58.8,16.89 | v49.02,15.24 46.99,13.21 28.57,13.21 27.94,13.84 v27.94,27.94 | v27.94,35.18 27.94,38.99 28.32,39.37 30.1,39.37 30.48,39.75 30.48,42.81 J2.1
  Top 0.254: C10.1 R18.1 R19.2 R20.2 R21.2
  Bottom 0.203: v58.8,16.89 50.67,16.89 v49.02,15.24 | v27.94,27.94 v27.94,35.18
STAT1
  Top 0.254: U2.8 R21.1
STAT2
  Top 0.254: U2.7 74.43,4.96 73.66,4.19 R20.1
TXD  (via drill 0.4)
  Top 0.203: A1.34 79.5,49.53 79.76,49.28 79.76,38.23 81.57,36.41 R5.1 81.57,34.51 v82.17,33.91 | v82.68,21.84 82.68,20.82 D2.A
  Bottom 0.203: v82.17,33.91 83.31,32.77 83.31,22.48 v82.68,21.84
V+  (via drill 0.4)
  Top 0.203: U3.12 66.89,6.6 C11.1 67.73,6.57 67.94,6.35 67.94,5.46 68.58,4.83 v68.58,3.68 | PB1.1 81.95,44.66 82.55,44.07 82.55,39.71 PB1.3 | v68.58,1.65 68.58,1.14 68.96,0.76 82.55,0.76 83.69,1.91 v83.69,13.21 | 81.92,39.07 PB1.3 | PB1.3 81.95,38.31 82.42,37.85 v83.69,37.85
  Top 0.254: U3.6 63.5,6.1 64,6.6 U3.12
  Top 0.305: U2.20 73.06,9.62 73.03,9.59 73.03,8.64 73.01,8.62 U2.1
  Top 0.406: v63.25,14.22 65.53,14.22 66.89,12.86 66.89,10.29
  Top 0.61: 73.06,9.62 72.35,10.33 C7.1 70.65,10.33 70.61,10.29 66.89,10.29 66.89,6.6
  Bottom 0.203: v68.58,3.68 v68.58,1.65 | v83.69,13.21 84.45,13.97 84.45,37.08 v83.69,37.85
  Bottom 0.406: J7.12 J5.12 16.51,12.95 17.4,12.06 49.28,12.06 51.44,14.22 v63.25,14.22
  pour Top (no thermals): 65.02,6.6 65.79,6.6 66.17,6.22 67.31,6.22 67.31,6.99 65.41,6.99
VDD  (via drill 0.4)
  Top 0.203: 73.03,25.78 75.69,25.78 v76.2,25.27 | v78.36,23.24 78.78,23.24 R6.2
  Top 0.305: U1.6 73.93,23.52 73.03,24.42 73.03,25.78 C4.1 72.61,25.4 70.87,25.4 70.48,25.78 C3.1 R1.1 R4.2 67.94,24.3 R7.2
  Bottom 0.203: v76.2,25.27 76.2,23.5 76.45,23.24 v78.36,23.24

### Text on the board
tPlace: (A2)SNS_BTN | SNS_STAT(A4) | B- | B+ | gCore ESP32 Controller | for the Adafruit 3.5" TFT Featherwing | (c) 2020 danjuliodesigns, LLC | Rev 2 | B- | B+
bPlace: RESET | 3V3 | GND | 26/A0 | 25/A1 | 34/A2 | 39/ A3 | 36/A4 | 4/A5 | 5/SCK | 19/MISO | 21 | 18/MOSI | V+ | EN | VUSB | 13 | 12 | 27 | 33 | 15 | 32 | 14 | 22/SCL | 23/SDA